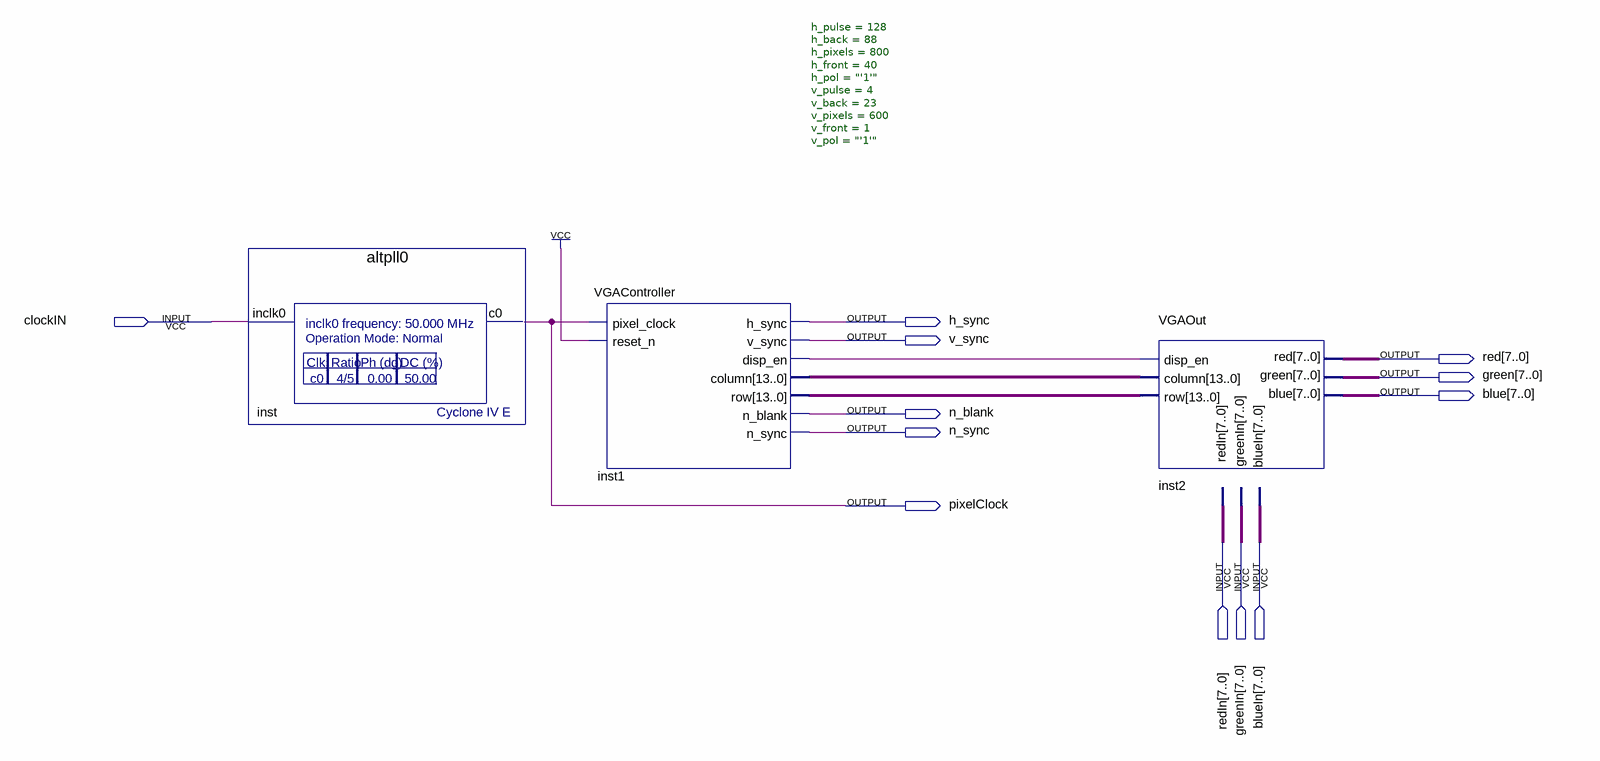
[diagram p0: schematic sheet]
// Quartus schematic VGAOutput.bdf as structural Verilog: 3 symbols, 12 pins
module VGAOutput (
  input  clockIN,
  input  [7:0] redIn,
  input  [7:0] greenIn,
  input  [7:0] blueIn,
  output h_sync,
  output v_sync,
  output [7:0] red,
  output [7:0] green,
  output [7:0] blue,
  output n_blank,
  output n_sync,
  output pixelClock
);

  wire inst1_disp_en;
  wire [13:0] inst1_column, inst1_row;

  altpll0 inst (.inclk0(clockIN), .c0(pixelClock));
  VGAController #(.h_pulse(128), .h_back(88), .h_pixels(800), .h_front(40), .h_pol("'1'"), .v_pulse(4), .v_back(23), .v_pixels(600), .v_front(1), .v_pol("'1'")) inst1 (
    .pixel_clock(pixelClock), .reset_n(1'b1), .h_sync(h_sync), .v_sync(v_sync), .disp_en(inst1_disp_en),
    .column(inst1_column), .row(inst1_row), .n_blank(n_blank), .n_sync(n_sync));
  VGAOut inst2 (
    .disp_en(inst1_disp_en), .column(inst1_column), .row(inst1_row), .redIn(redIn), .greenIn(greenIn),
    .blueIn(blueIn), .red(red), .green(green), .blue(blue));
endmodule
